# Altium schematic sheet Sheet1.SchDoc
size A4
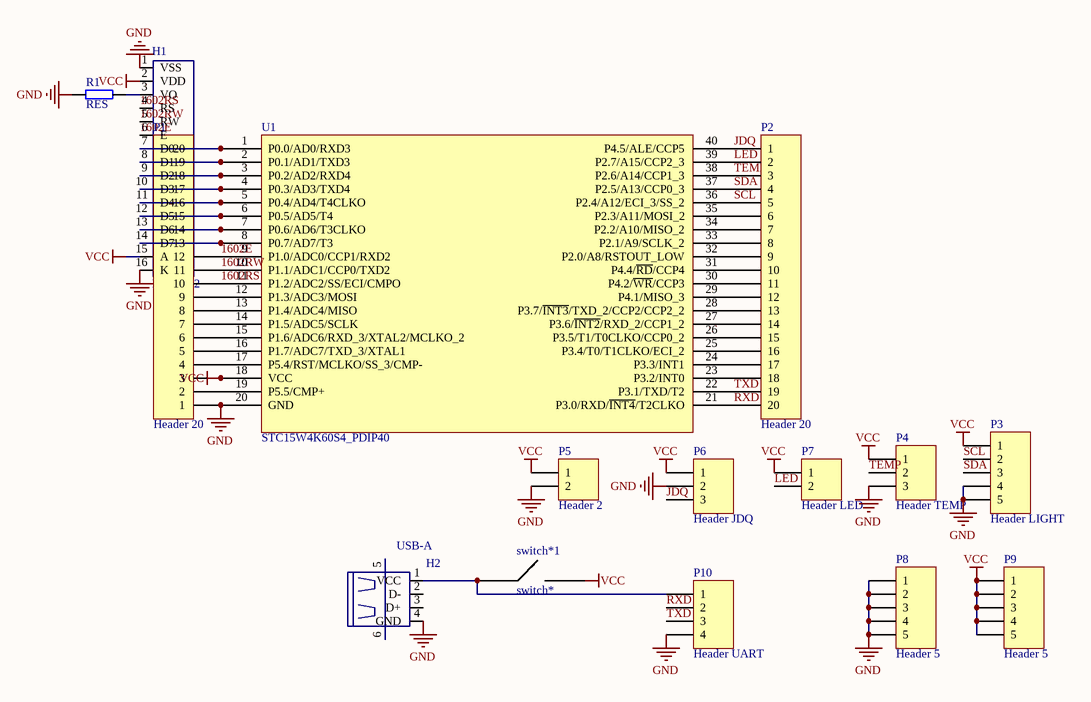
[diagram p0: Sheet1.SchDoc]

## Parts
H1  LCD1602  [H_LCD(1602)]
H2  USB-A  [USB-A]
P1  Header 20  [HDR1X20]
P2  Header 20  [HDR1X20]
P3  Header LIGHT  [HDR1X5]
P4  Header TEMP  [HDR1X3]
P5  Header 2  [HDR1X2]
P6  Header JDQ  [HDR1X3]
P7  Header LED  [HDR1X2]
P8  Header 5  [HDR1X5]
P9  Header 5  [HDR1X5]
P10  Header UART  [HDR1X4]
R1  RES  [RES_IP]
switch*1  switch*  [switch]
U1  STC15W4K60S4_PDIP40  [DIP40]

## Nets
GND: H1.1(VSS) H1.16(K) H2.4(GND) P1.1 P3.4 P3.5 P4.3 P5.2 P6.2 P8.1 P8.2 P8.3 P8.4 P8.5 P10.4 R1.1 U1.20(GND)
VCC: H1.2(VDD) H1.15(A) P1.3 P3.1 P4.1 P5.1 P6.1 P7.1 P9.1 P9.2 P9.3 P9.4 P9.5 switch*1.1 U1.18(VCC)
1602E: H1.6(E) P1.12 U1.9(P1.0/ADC0/CCP1/RXD2)
1602RS: H1.4(RS) P1.10 U1.11(P1.2/ADC2/SS/ECI/CMPO)
1602RW: H1.5(RW) P1.11 U1.10(P1.1/ADC1/CCP0/TXD2)
JDQ: P2.1 P6.3 U1.40(P4.5/ALE/CCP5)
LED: P2.2 P7.2 U1.39(P2.7/A15/CCP2_3)
RXD: P2.20 P10.2 U1.21(P3.0/RXD/~{INT4}/T2CLKO)
SCL: P2.5 P3.2 U1.36(P2.4/A12/ECI_3/SS_2)
SDA: P2.4 P3.3 U1.37(P2.5/A13/CCP0_3)
TEMP: P2.3 P4.2 U1.38(P2.6/A14/CCP1_3)
TXD: P2.19 P10.3 U1.22(P3.1/TXD/T2)
NetH1_3: H1.3(VO) R1.2
NetH1_7: H1.7(D0) P1.20 U1.1(P0.0/AD0/RXD3)
NetH1_8: H1.8(D1) P1.19 U1.2(P0.1/AD1/TXD3)
NetH1_9: H1.9(D2) P1.18 U1.3(P0.2/AD2/RXD4)
NetH1_10: H1.10(D3) P1.17 U1.4(P0.3/AD3/TXD4)
NetH1_11: H1.11(D4) P1.16 U1.5(P0.4/AD4/T4CLKO)
NetH1_12: H1.12(D5) P1.15 U1.6(P0.5/AD5/T4)
NetH1_13: H1.13(D6) P1.14 U1.7(P0.6/AD6/T3CLKO)
NetH1_14: H1.14(D7) P1.13 U1.8(P0.7/AD7/T3)
NetH2_1: H2.1(VCC) P10.1 switch*1.0
NetH2_5: H2.5 H2.6
NetP1_2: P1.2 U1.19(P5.5/CMP+)
NetP1_4: P1.4 U1.17(P5.4/RST/MCLKO/SS_3/CMP-)
NetP1_5: P1.5 U1.16(P1.7/ADC7/TXD_3/XTAL1)
NetP1_6: P1.6 U1.15(P1.6/ADC6/RXD_3/XTAL2/MCLKO_2)
NetP1_7: P1.7 U1.14(P1.5/ADC5/SCLK)
NetP1_8: P1.8 U1.13(P1.4/ADC4/MISO)
NetP1_9: P1.9 U1.12(P1.3/ADC3/MOSI)
NetP2_6: P2.6 U1.35(P2.3/A11/MOSI_2)
NetP2_7: P2.7 U1.34(P2.2/A10/MISO_2)
NetP2_8: P2.8 U1.33(P2.1/A9/SCLK_2)
NetP2_9: P2.9 U1.32(P2.0/A8/RSTOUT_LOW)
NetP2_10: P2.10 U1.31(P4.4/~{RD}/CCP4)
NetP2_11: P2.11 U1.30(P4.2/~{WR}/CCP3)
NetP2_12: P2.12 U1.29(P4.1/MISO_3)
NetP2_13: P2.13 U1.28(P3.7/~{INT3}/TXD_2/CCP2/CCP2_2)
NetP2_14: P2.14 U1.27(P3.6/~{INT2}/RXD_2/CCP1_2)
NetP2_15: P2.15 U1.26(P3.5/T1/T0CLKO/CCP0_2)
NetP2_16: P2.16 U1.25(P3.4/T0/T1CLKO/ECI_2)
NetP2_17: P2.17 U1.24(P3.3/INT1)
NetP2_18: P2.18 U1.23(P3.2/INT0)

Not connected (* = marked no-connect by the designer): H2 2(D-) 3(D+)

## Library data of the parts
P1 P2 = Header 20: Header, 20-Pin; LatestRevisionDate: 17-Jul-2002; LatestRevisionNote: Re-released for DXP Platform.; Publisher: Altium Limited
P3 P8 P9 = Header 5: Header, 5-Pin; LatestRevisionDate: 17-Jul-2002; LatestRevisionNote: Re-released for DXP Platform.; Publisher: Altium Limited
P4 P6 = Header 3: Header, 3-Pin; LatestRevisionDate: 17-Jul-2002; LatestRevisionNote: Re-released for DXP Platform.; Publisher: Altium Limited
P5 P7 = Header 2: Header, 2-Pin; LatestRevisionDate: 17-Jul-2002; LatestRevisionNote: Re-released for DXP Platform.; Publisher: Altium Limited
P10 = Header 4: Header, 4-Pin; LatestRevisionDate: 17-Jul-2002; LatestRevisionNote: Re-released for DXP Platform.; Publisher: Altium Limited
switch*1 = switch